# Altium schematic sheet Drive_Motors.SchDoc
size B; SheetNumber: 2; SheetTotal: 2
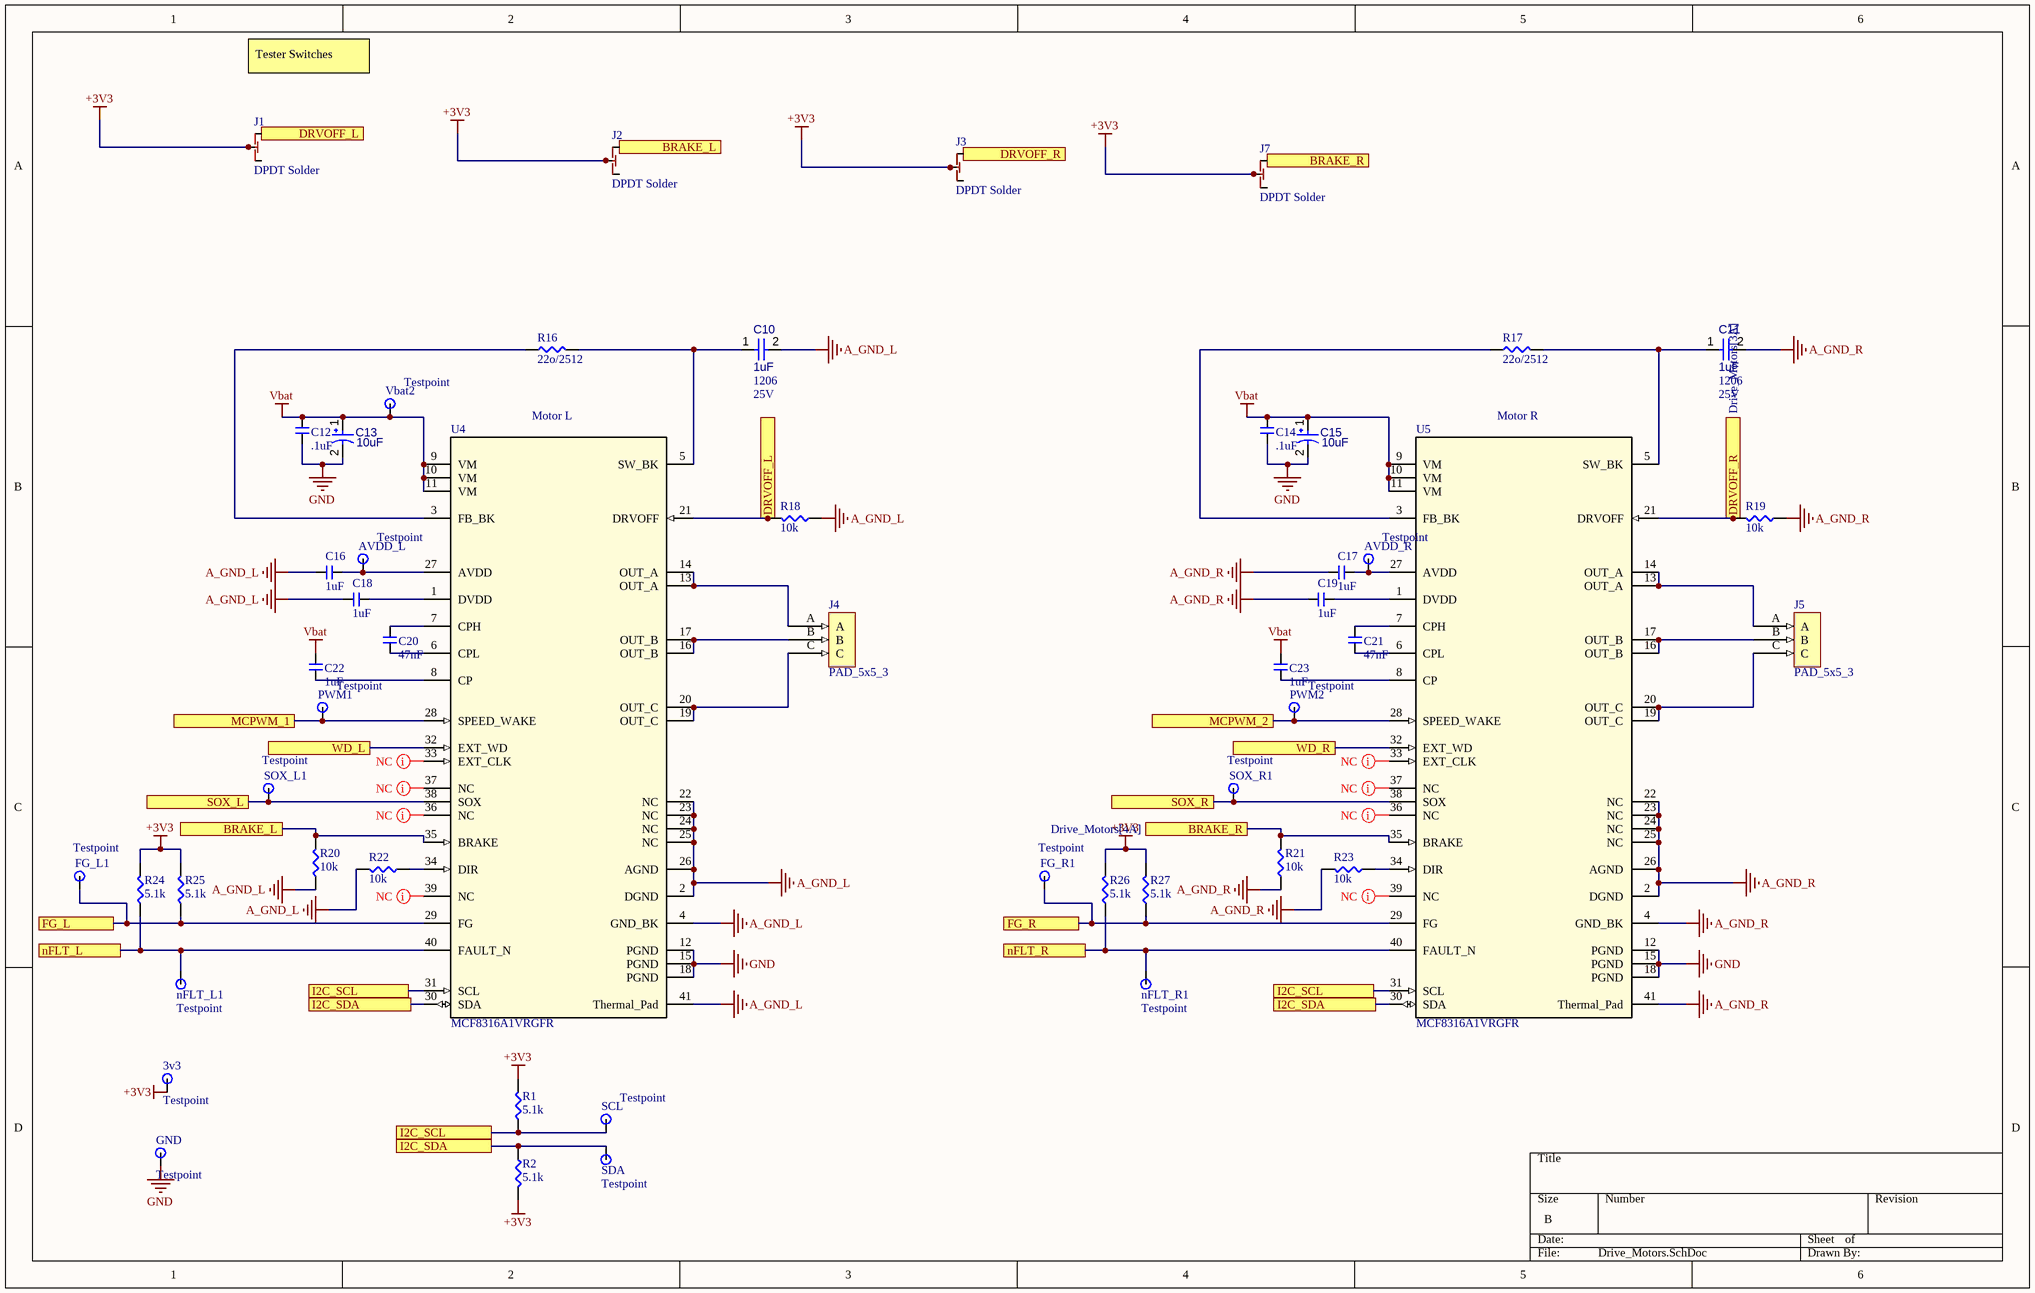
[diagram p0: Drive_Motors.SchDoc]

## Parts
3v3  Testpoint  [Testpoint]
AVDD_L  Testpoint  [Testpoint]
AVDD_R  Testpoint  [Testpoint]
C10  1uF  Pins: 1206  Voltage Rating: 25V  [CAPC0603(1608)100_L]
C11  1uF  Pins: 1206  Voltage Rating: 25V  [CAPC0603(1608)100_L]
C12  .1uF  [CAP-0603]
C13  10uF  [EEF-CX1E330R-Footprint-1]
C14  .1uF  [CAP-0603]
C15  10uF  [EEF-CX1E330R-Footprint-1]
C16  1uF  [CAP-0603]
C17  1uF  [CAP-0603]
C18  1uF  [CAP-0603]
C19  1uF  [CAP-0603]
C20  47nF  [CAP-0603]
C21  47nF  [CAP-0603]
C22  1uF  [CAP-0603]
C23  1uF  [CAP-0603]
FG_L1  Testpoint  [Testpoint]
FG_R1  Testpoint  [Testpoint]
GND  Testpoint  [Testpoint]
J1  DPDT Solder  [DPDT Solder]
J2  DPDT Solder  [DPDT Solder]
J3  DPDT Solder  [DPDT Solder]
J4  PAD_5x5_3  [PAD_5x5_3-Footprint-1]
J5  PAD_5x5_3  [PAD_5x5_3-Footprint-1]
J7  DPDT Solder  [DPDT Solder]
nFLT_L1  Testpoint  [Testpoint]
nFLT_R1  Testpoint  [Testpoint]
PWM1  Testpoint  [Testpoint]
PWM2  Testpoint  [Testpoint]
R1  5.1k  [RES-0603]
R2  5.1k  [RES-0603]
R16  22o/2512  [RES-2512]
R17  22o/2512  [RES-2512]
R18  10k  [RES-0603]
R19  10k  [RES-0603]
R20  10k  [RES-0603]
R21  10k  [RES-0603]
R22  10k  [RES-0603]
R23  10k  [RES-0603]
R24  5.1k  [RES-0603]
R25  5.1k  [RES-0603]
R26  5.1k  [RES-0603]
R27  5.1k  [RES-0603]
SCL  Testpoint  [Testpoint]
SDA  Testpoint  [Testpoint]
SOX_L1  Testpoint  [Testpoint]
SOX_R1  Testpoint  [Testpoint]
U4  MCF8316A1VRGFR  [RGF0040E-IPC_A]
U5  MCF8316A1VRGFR  [RGF0040E-IPC_A]
Vbat2  Testpoint  [Testpoint]

## Ports
BRAKE_L (see Drive_Motors[1C]), BRAKE_L (see Drive_Motors[2A]), BRAKE_R (see Drive_Motors[4A]), BRAKE_R (see Drive_Motors[4C]), DRVOFF_L (see Drive_Motors[1A]), DRVOFF_L (see Drive_Motors[3B]), DRVOFF_R (see Drive_Motors[3A]), DRVOFF_R (see Drive_Motors[6B]), FG_L, FG_R, I2C_SCL (see Drive_Motors[1D], Drive_Motors[2D], Weapon_Motor[2B]), I2C_SCL (see Drive_Motors[1D], Drive_Motors[4D], Weapon_Motor[2B]), I2C_SCL (see Drive_Motors[2D], Drive_Motors[4D], Weapon_Motor[2B]), I2C_SDA (see Drive_Motors[1D], Drive_Motors[2D], Weapon_Motor[2B]), I2C_SDA (see Drive_Motors[1D], Drive_Motors[4D], Weapon_Motor[2B]), I2C_SDA (see Drive_Motors[2D], Drive_Motors[4D], Weapon_Motor[2B]), MCPWM_1, MCPWM_2, nFLT_L, nFLT_R, SOX_L, SOX_R, WD_L, WD_R

## Nets
+3V3: 3v3.1 J1.3 J2.3 J3.3 J7.3 R1.2 R2.2 R24.2 R25.2 R26.2 R27.2
A_GND_L: C10.2 C16.2 C18.2 R18.1 R20.1 R22.2 U4.2(DGND) U4.4(GND_BK) U4.22(NC) U4.23(NC) U4.24(NC) U4.25(NC) U4.26(AGND) U4.41(Thermal_Pad)
A_GND_R: C11.2 C17.2 C19.2 R19.1 R21.1 R23.2 U5.2(DGND) U5.4(GND_BK) U5.22(NC) U5.23(NC) U5.24(NC) U5.25(NC) U5.26(AGND) U5.41(Thermal_Pad)
GND: C12.1 C13.2 C14.1 C15.2 GND.1 U4.12(PGND) U4.15(PGND) U4.18(PGND) U5.12(PGND) U5.15(PGND) U5.18(PGND)
Vbat: C12.2 C13.1 C14.2 C15.1 C22.2 C23.2 U4.9(VM) U4.10(VM) U4.11(VM) U5.9(VM) U5.10(VM) U5.11(VM) Vbat2.1
BRAKE_L: J2.1 R20.2 U4.35(BRAKE) ; port BRAKE_L
BRAKE_R: J7.1 R21.2 U5.35(BRAKE) ; port BRAKE_R
DRVOFF_L: J1.1 R18.2 U4.21(DRVOFF) ; port DRVOFF_L
DRVOFF_R: J3.1 R19.2 U5.21(DRVOFF) ; port DRVOFF_R
FG_L: FG_L1.1 R25.1 U4.29(FG) ; port FG_L
FG_R: FG_R1.1 R27.1 U5.29(FG) ; port FG_R
I2C_SCL: R1.1 SCL.1 U4.31(SCL) U5.31(SCL) ; port I2C_SCL
I2C_SDA: R2.1 SDA.1 U4.30(SDA) U5.30(SDA) ; port I2C_SDA
MCPWM_1: PWM1.1 U4.28(SPEED_WAKE) ; port MCPWM_1
MCPWM_2: PWM2.1 U5.28(SPEED_WAKE) ; port MCPWM_2
nFLT_L: nFLT_L1.1 R24.1 U4.40(FAULT_N) ; port nFLT_L
nFLT_R: nFLT_R1.1 R26.1 U5.40(FAULT_N) ; port nFLT_R
SOX_L: SOX_L1.1 U4.38(SOX) ; port SOX_L
SOX_R: SOX_R1.1 U5.38(SOX) ; port SOX_R
WD_L: U4.32(EXT_WD) ; port WD_L
WD_R: U5.32(EXT_WD) ; port WD_R
NetAVDD_L_1: AVDD_L.1 C16.1 U4.27(AVDD)
NetAVDD_R_1: AVDD_R.1 C17.1 U5.27(AVDD)
NetC10_1: C10.1 R16.2 U4.5(SW_BK)
NetC11_1: C11.1 R17.2 U5.5(SW_BK)
NetC18_1: C18.1 U4.1(DVDD)
NetC19_1: C19.1 U5.1(DVDD)
NetC20_1: C20.1 U4.7(CPH)
NetC20_2: C20.2 U4.6(CPL)
NetC21_1: C21.1 U5.7(CPH)
NetC21_2: C21.2 U5.6(CPL)
NetC22_1: C22.1 U4.8(CP)
NetC23_1: C23.1 U5.8(CP)
NetJ4_A: J4.A U4.13(OUT_A) U4.14(OUT_A)
NetJ4_B: J4.B U4.16(OUT_B) U4.17(OUT_B)
NetJ4_C: J4.C U4.19(OUT_C) U4.20(OUT_C)
NetJ5_A: J5.A U5.13(OUT_A) U5.14(OUT_A)
NetJ5_B: J5.B U5.16(OUT_B) U5.17(OUT_B)
NetJ5_C: J5.C U5.19(OUT_C) U5.20(OUT_C)
NetR16_1: R16.1 U4.3(FB_BK)
NetR17_1: R17.1 U5.3(FB_BK)
NetR22_1: R22.1 U4.34(DIR)
NetR23_1: R23.1 U5.34(DIR)

Not connected (* = marked no-connect by the designer): J1 2; J2 2; J3 2; J7 2; U4 33(EXT_CLK) 36(NC) 37(NC) 39(NC); U5 33(EXT_CLK) 36(NC) 37(NC) 39(NC)

## Layout directives
mark named NC: NetU4_33, NetU4_36, NetU4_37, NetU4_39, NetU5_33, NetU5_36, NetU5_37, NetU5_39

## Notes on the sheet
- Tester Switches
- Motor L
- Motor R

## Library data of the parts
3v3 AVDD_L AVDD_R FG_L1 FG_R1 GND nFLT_L1 nFLT_R1 PWM1 PWM2 SCL SDA SOX_L1 SOX_R1 Vbat2 = CMP-009-000182-1: Design Item ID: Testpoint; Source: ife19_Elec_Library.SchLib
C10 C11 = CMP-005-000566-1: Chip Capacitor, 1 uF, +/- 10%, 25 V, 1206 (3216 Metric); Available Preview Images: 2D; Design Item ID: CMP-001-00006-4; Source: Integrated_Library - 12.03.21 - 15.39.SchLib
C12 C14 C16-C19 C22 C23 = CMP-009-000303-1: X5R or X7R, 16V ceramic; Source: ife19_Elec_Library.SchLib; Design Item ID: CAP-0603
C13 C15 = CMP-005-000585-1: Aluminum Electrolytic Capacitor, 10 uF, +/- 20%, 50 V, -40 to 85 degC, 2-Pin THD, RoHS, Bulk; Manufacturer: Panasonic; Design Item ID: CMP-001-00025-5; Source: Integrated_Library - 12.03.21 - 15.39.SchLib
C20 C21 = CMP-009-000303-1: X5R or X7R, >32V ceramic; Source: ife19_Elec_Library.SchLib; Design Item ID: CAP-0603
J1-J3 J7 = CMP-081-000002-1: Source: LTC6811.SchLib; Design Item ID: DPDT Solder
J4 J5 = CMP-057-000231-1: 3 5x5mm pads; ComponentLink4Description: http://datasheet.octopart.com/172065-0308-Molex-datasheet-96710946.pdf?src-supplier=Farnell; ComponentLink1Description: http://datasheet.octopart.com/172065-0306-Molex-datasheet-101610458.pdf?src-supplier=Farnell; ComponentLink3Description: http://datasheet.octopart.com/172065-0308-Molex-datasheet-101610459.pdf?src-supplier=Farnell; ComponentLink2Description: http://datasheet.octopart.com/172065-0306-Molex-datasheet-96710945.pdf?src-supplier=Farnell
R1 R2 R18-R27 = CMP-014-000032-1: Source: ife19_Elec_Library.SchLib; Design Item ID: RES-0603
R16 R17 = CMP-055-000013-1: Source: ife19_Elec_Library.SchLib; Design Item ID: RES-2512
U4 U5 = CMP-231-000000-2: No Description Available; Mfr_Name: Texas Instruments; Source: MCF8316A1VRGFR.SchLib; RefDes: RefDes; Design Item ID: MCF8316A1VRGFR; TYPE: TYPE